# Altium schematic sheet typeC.SchDoc
size 209 x 297 mm; DocumentCode: Децимальный номер; SchemeType: Схема электрическая принципиальная; PageSetup: Record=PageOptionsZCenterHorizontal=TrueZCenterVertical=TrueZPrintScale=0.95ZXCorrection=1.00ZYCorrection=1.00ZPrintKind=2ZBorderSize=5000000ZLeftOffset=0ZBottomOffset=0ZOrientation=1ZPaperLength=1000ZPaperWidth=1000ZScale=100ZPaperSource=7ZPrintQuality=600ZMediaType=1ZDitherType=10ZPaperKind=A4 (210 x 297 мм)ZPrintScaleMode=1
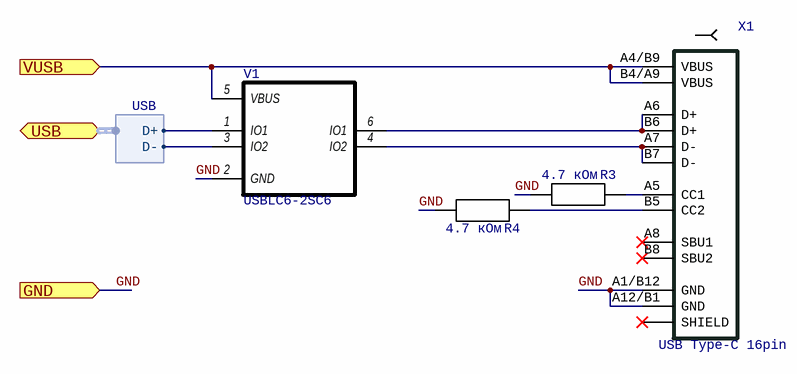
[diagram p0: typeC.SchDoc]

## Parts
R3  value 4.7 кОм  [STD-0402]  (hidden comment: res)
R4  value 4.7 кОм  [STD-0402]  (hidden comment: res)
V1  USBLC6-2SC6  [SOT-23-6]
X1  USB Type-C 16pin  [USB Type-C]

## Ports
GND (in), USB (harness USB), VUSB (in)

## Harnesses
USB: D+, D-

## Nets
GND: R3.2 R4.2 V1.2(GND) X1.A1/B12(GND) X1.A12/B1(GND) ; port GND
VUSB: V1.5(VBUS) X1.A4/B9(VBUS) X1.B4/A9(VBUS) ; port VUSB
NetR3_1: R3.1 X1.A5(CC1)
NetR4_1: R4.1 X1.B5(CC2)
NetV1_1: V1.1(IO1) ; port USB.D+
NetV1_3: V1.3(IO2) ; port USB.D-
NetV1_4: V1.4(IO2) X1.A7(D-) X1.B7(D-)
NetV1_6: V1.6(IO1) X1.A6(D+) X1.B6(D+)

Not connected (* = marked no-connect by the designer): X1 A8(SBU1)* B8(SBU2)* SHIELD*

## Notes on the sheet
- Перв. примен.
- Справ. №
- Подп. и дата
- Инв. № дубл.
- Взам. инв. №
- Изм.
- Лист
- № докум.
- Подп.
- Дата
- Инв. № подл.
- Копировал
- Формат А4

## Library data of the parts
R3 R4 = R0402-4k7-1%-1/16W: Резистор; Part Number: R0402-4k7-1%-1/16W
V1 = CMP-0703-A.2: ESD защита, 3.5 пФ, 150 нА, USB; Manufacturer: ST Microelectronics; Temperature: -40 - 150°C
X1 = USB Type-C 16 pin ALI: USB Type-C; Part Number: USB Type-C 16 pin ALI